# EasyEDA Pro project SprinKlr-8 Rev1.epro, board PCB1
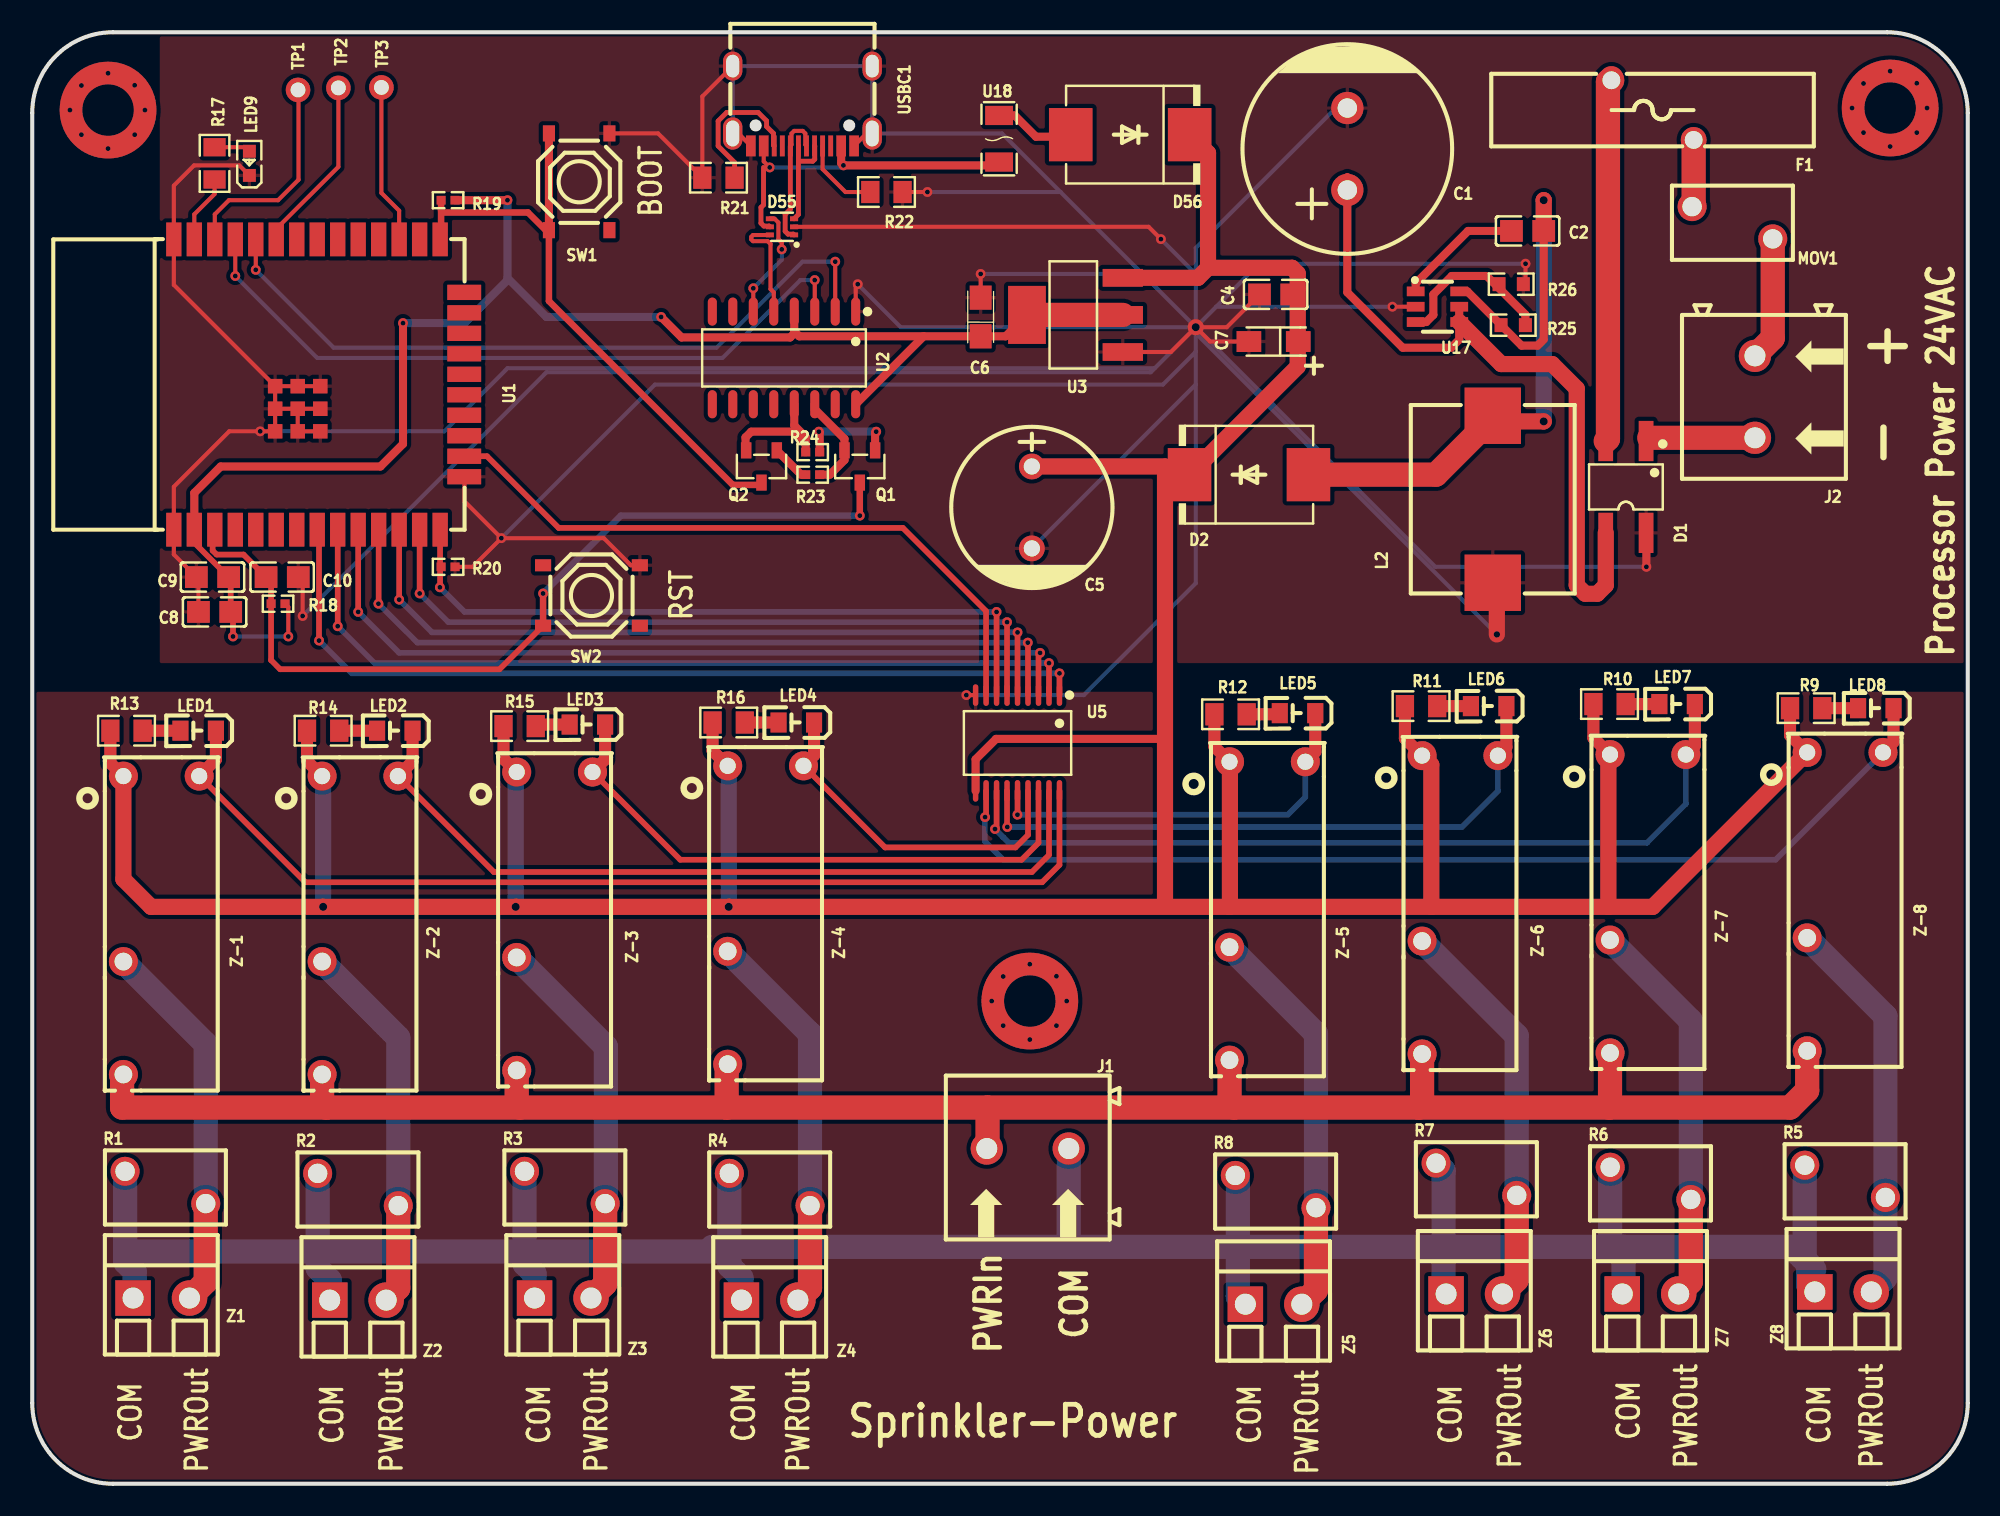
[diagram p1: board, top side]
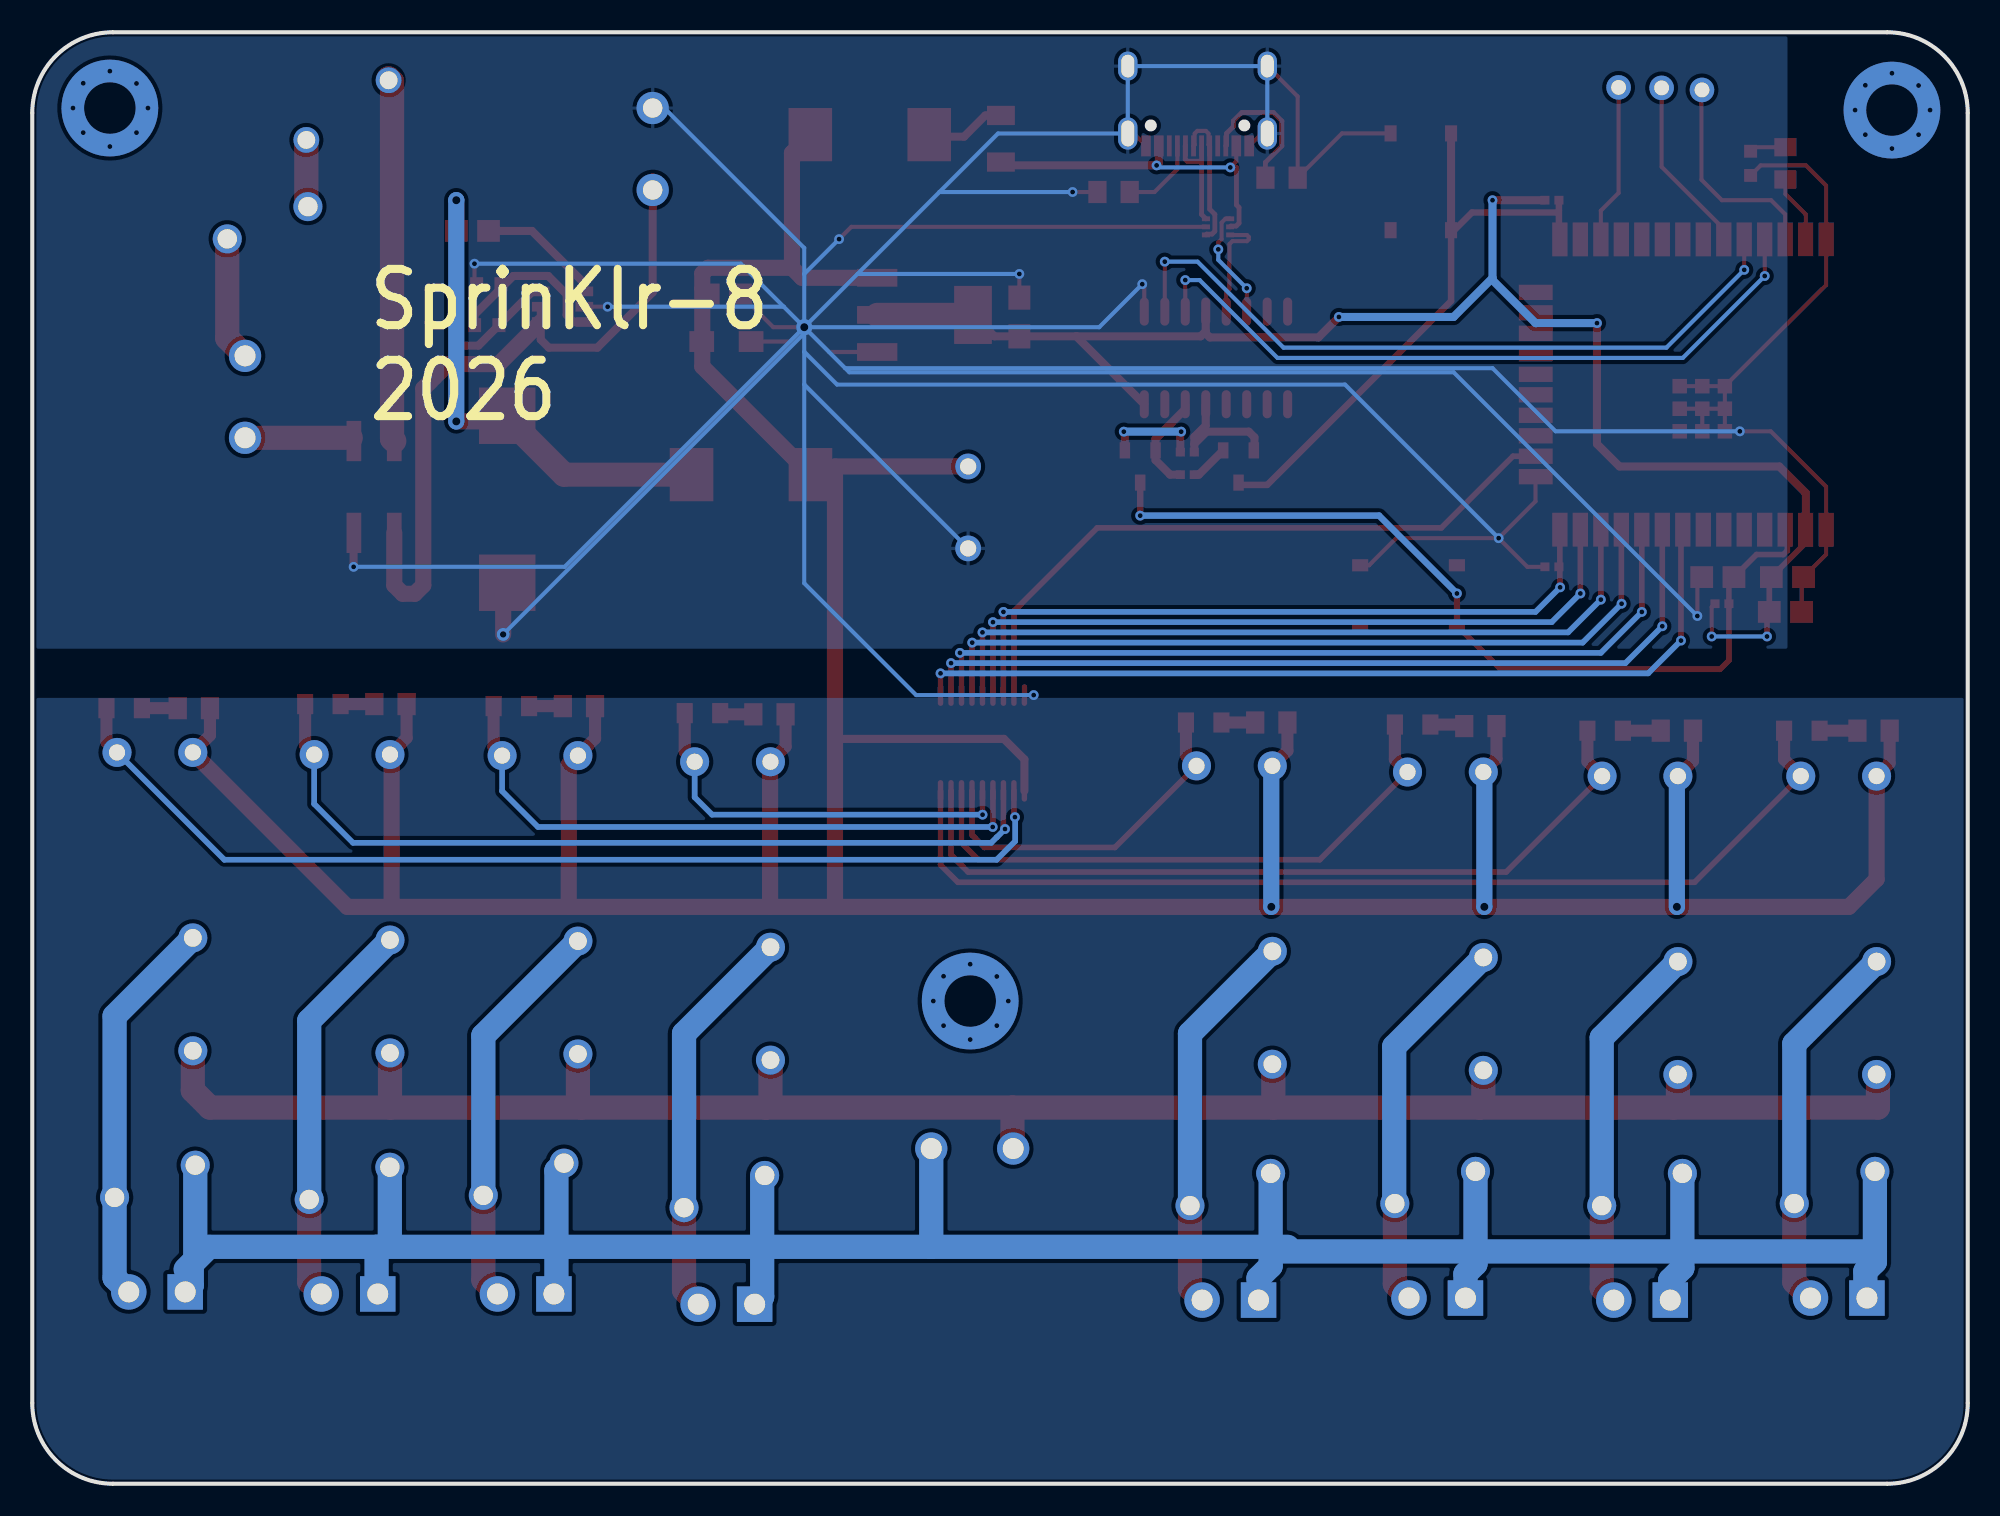
[diagram p2: board, bottom side, seen from below]

Outline 120 x 90 mm; copper layers: Top Layer, Bottom Layer. Coordinates in mm from the lower left corner of the outline.
Outline path: 0,85 0,5 arc(1.46,1.46) 5,0 115,0 arc(118.54,1.46) 120,5 120,85 arc(118.54,88.54) 115,90 5,90 arc(1.46,88.54) 0,85
Stack: Top Layer 0.035mm / Dielectric1 1.51mm FR4 er 4.5 / Bottom Layer 0.035mm

## Design rules (mm)
net $1N11762: DP1
net $1N11753: DP1
spacing copperThickness1oz (default): track to track 0.102, other pairs 0.152 to 0.3
spacing copperThickness2oz: track to track 0.203, other pairs 0.152 to 0.3
spacing Plane_innerPlane: track to track 0.102, other pairs 0.152 to 0.3
spacing Copper_copperRegion: track to track 0.102, other pairs 0.152 to 0.3
track width copperThickness1oz (default): min 0.127, default 0.254, max 2.54
track width copperThickness2oz: min 0.203, default 0.254, max 2.54
differential pair differentialPair (default): width min 0.127, default 0.254, max 2.54; gap min 0.152, default 0.152
differential pair differentialPair1: width min 0.127, default 0.254, max 2.54; gap min 0.152, default 0.152
net GND uses copperRegion_copperThickness1oz
pour e1026 uses Copper_copperRegion, copperRegion_Copper_copperRegion
pour e1129 uses Copper_copperRegion, copperRegion_Copper_copperRegion
pour e1133 uses Copper_copperRegion, copperRegion_Copper_copperRegion
pour e1159 uses Copper_copperRegion, copperRegion_Copper_copperRegion

## Placement (name value [footprint] x y rotation side)
C1  470uF  [CAP-TH_BD13.0-P5.00-D1.2-FD]  81.53 82.76 90 top
C2  100nF  [C0805]  92.71 77.68 180 top
C4  100nF  [C0805]  77.09 73.74 180 top
C5  220uF  [CAP-TH_BD10.0-P5.00-D1.0-FD]  61.98 60.54 270 top
C6  22uF  [CASE-A_3216]  58.8 72.35 90 top
C7  10uF  [CAP-SMD_L3.2-W1.6-RD-C7171]  76.96 70.82 180 top
C8  10uF  [C0805]  11.3 54.06 0 top
C9  100nF  [C0805]  11.18 56.22 0 top
C10  100nF  [C0805]  15.49 56.22 180 top
D1  MB210S  [MBS_L4.7-W4.0-P2.50-LS7.0-BL]  98.81 61.81 180 top
D2  SS35  [SMC_L6.9-W5.9-LS7.9-RD]  75.44 62.57 0 top
D55  USBLC6-2P6  [SOT-666-6_L1.6-W1.2-P0.50-LS1.6-BL]  46.48 77.93 90 top
D56  SS35  [SMC_L6.9-W5.9-LS7.9-RD]  68.07 83.65 180 top
F1  RL250-800  [FUSE-TH_L20.0-W4.5-P5.10-D0.8-S3.70]  100.46 85.17 0 top
J1  WJ500V-5.08-2P  [CONN-TH_2P-P5.00_WJ500V-5.08-2P]  61.72 20.78 180 top
J2  WJ500V-5.08-2P  [CONN-TH_2P-P5.00_WJ500V-5.08-2P]  106.81 67.39 270 top
L2  100uH  [IND-SMD_L11.5-W10.0]  90.55 61.04 270 top
LED1  NCD0805R1  [LED0805-RD]  10.29 46.69 180 top
LED2  NCD0805R1  [LED0805-RD]  22.48 46.69 180 top
LED3  NCD0805R1  [LED0805-RD]  34.42 47.07 180 top
LED4  NCD0805R1  [LED0805-RD]  47.37 47.2 180 top
LED5  NCD0805R1  [LED0805-RD]  78.45 47.78 180 top
LED6  NCD0805R1  [LED0805-RD]  90.3 48.22 180 top
LED7  NCD0805R1  [LED0805-RD]  101.98 48.34 180 top
LED8  NCD0805R1  [LED0805-RD]  114.3 48.09 180 top
LED9  19-217/GHC-YR1S2/3T  [LED0603-RD]  13.46 81.87 90 top
MOV1  250pF@1kHz  [RES-TH_L7.5-W4.6-P5.00-D1.2-S2.00]  105.41 78.19 180 top
NOREF  -  [Pad_e794]  18.98 86.55 0 top
NOREF#2  -  [Pad_e793]  16.48 86.42 0 top
NOREF#3  -  [Pad_e795]  21.65 86.58 0 top
Q1  MMBT3904  [SOT-23-3_L2.9-W1.3-P1.90-LS2.4-BR]  51.31 63.08 90 top
Q2  MMBT3904  [SOT-23-3_L2.9-W1.3-P1.90-LS2.4-BR]  45.21 63.08 90 top
R1  250pF@1kHz  [RES-TH_L7.5-W4.6-P5.00-D1.2-S2.00]  8.25 18.37 0 top
R2  250pF@1kHz  [RES-TH_L7.5-W4.6-P5.00-D1.2-S2.00]  20.19 18.25 0 top
R3  250pF@1kHz  [RES-TH_L7.5-W4.6-P5.00-D1.2-S2.00]  33.02 18.37 0 top
R4  250pF@1kHz  [RES-TH_L7.5-W4.6-P5.00-D1.2-S2.00]  45.72 18.25 0 top
R5  250pF@1kHz  [RES-TH_L7.5-W4.6-P5.00-D1.2-S2.00]  112.4 18.75 0 top
R6  250pF@1kHz  [RES-TH_L7.5-W4.6-P5.00-D1.2-S2.00]  100.33 18.63 0 top
R7  250pF@1kHz  [RES-TH_L7.5-W4.6-P5.00-D1.2-S2.00]  89.53 18.88 0 top
R8  250pF@1kHz  [RES-TH_L7.5-W4.6-P5.00-D1.2-S2.00]  77.09 18.12 0 top
R9  470Ω  [R0805]  109.98 48.09 180 top
R10  470Ω  [R0805]  97.79 48.34 180 top
R11  470Ω  [R0805]  86.11 48.22 180 top
R12  470Ω  [R0805]  74.29 47.71 180 top
R13  470Ω  [R0805]  5.84 46.69 180 top
R14  470Ω  [R0805]  18.03 46.69 180 top
R15  470Ω  [R0805]  30.22 46.98 180 top
R16  470Ω  [R0805]  43.18 47.2 180 top
R17  330Ω  [R0805]  11.3 81.87 270 top
R18  10kΩ  [R0402]  15.24 54.57 180 top
R19  10kΩ  [R0402]  25.78 79.59 0 top
R20  10kΩ  [R0402]  25.78 56.85 180 top
R21  5.1kΩ  [R0805]  42.54 80.98 180 top
R22  5.1kΩ  [R0805]  52.96 80.09 180 top
R23  10kΩ  [R0402]  48.39 62.57 180 top
R24  10kΩ  [R0402]  48.39 63.96 0 top
R25  43kΩ  [R0603]  91.82 71.84 180 top
R26  13kΩ  [R0603]  91.69 74.38 180 top
SW1  TS-1187A-B-A-B  [SW-SMD_4P-L5.1-W5.1-P3.70-LS6.5-TL_H1.5]  33.91 80.73 90 top
SW2  TS-1187A-B-A-B  [SW-SMD_4P-L5.1-W5.1-P3.70-LS6.5-TL_H1.5]  34.67 55.07 180 top
TP1  -  [Test-Point-0.5mm]  16.48 86.42 90 top
TP2  -  [Test-Point-0.5mm]  18.98 86.55 90 top
TP3  -  [Test-Point-0.5mm]  21.65 86.58 90 top
U1  2.4GHz  [WIFI-SMD_ESP32-WROOM-32E]  17.78 68.16 0 top
U2  CH340C  [SOP-16_L10.0-W3.9-P1.27-LS6.0-BL]  46.61 69.81 180 top
U3  AMS1117-3.3  [SOT-223-3_L6.5-W3.4-P2.30-LS7.0-BR]  64.64 72.47 0 top
U5  TBD62083AFNG,EL  [SSOP-18_L6.8-W4.4-P0.65-LS6.4-BL]  61.09 45.93 180 top
U17  LMR16006XDDCR  [SOT-23-6_L2.9-W1.6-P0.95-LS2.8-BR]  87.12 72.98 180 top
U18  1206L050/24NRT  [F1206]  59.94 83.4 270 top
USBC1  TYPE-C-31-M-12  [USB-C_SMD-TYPE-C-31-M-12_1]  47.75 85.43 180 top
Z1  DB125-3.5-2P-GN-S  [CONN-TH_2P-P3.50_L7.4-W7.0]  8 11.51 0 top
Z2  DB125-3.5-2P-GN-S  [CONN-TH_2P-P3.50_L7.4-W7.0]  20.19 11.39 0 top
Z3  DB125-3.5-2P-GN-S  [CONN-TH_2P-P3.50_L7.4-W7.0]  32.89 11.51 0 top
Z4  DB125-3.5-2P-GN-S  [CONN-TH_2P-P3.50_L7.4-W7.0]  45.72 11.39 0 top
Z5  DB125-3.5-2P-GN-S  [CONN-TH_2P-P3.50_L7.4-W7.0]  76.96 11.13 0 top
Z6  DB125-3.5-2P-GN-S  [CONN-TH_2P-P3.50_L7.4-W7.0]  89.41 11.77 0 top
Z7  DB125-3.5-2P-GN-S  [CONN-TH_2P-P3.50_L7.4-W7.0]  100.33 11.77 0 top
Z8  DB125-3.5-2P-GN-S  [CONN-TH_2P-P3.50_L7.4-W7.0]  112.27 11.89 0 top
Z-1  HF46F-G/5-HS1  [RELAYS-TH_HF46F-G-XX-HS1-XXX]  8 34.63 270 top
Z-2  HF46F-G/5-HS1  [RELAYS-TH_HF46F-G-XX-HS1-XXX]  20.32 34.63 270 top
Z-3  HF46F-G/5-HS1  [RELAYS-TH_HF46F-G-XX-HS1-XXX]  32.38 34.88 270 top
Z-4  HF46F-G/5-HS1  [RELAYS-TH_HF46F-G-XX-HS1-XXX]  45.47 35.26 270 top
Z-5  HF46F-G/5-HS1  [RELAYS-TH_HF46F-G-XX-HS1-XXX]  76.58 35.52 270 top
Z-6  HF46F-G/5-HS1  [RELAYS-TH_HF46F-G-XX-HS1-XXX]  88.52 35.9 270 top
Z-7  HF46F-G/5-HS1  [RELAYS-TH_HF46F-G-XX-HS1-XXX]  100.17 35.96 270 top
Z-8  HF46F-G/5-HS1  [RELAYS-TH_HF46F-G-XX-HS1-XXX]  112.4 36.1 270 top

## Footprints (pads in the part's own frame, mm; a bottom-side part is the same pattern mirrored in y, then rotated)
C0805
  rect 1.41x1.35 smd: 1(-1,0) 2(1,0)
CAP-SMD_L3.2-W1.6-RD-C7171
  rect 1.53x1.296 smd: 1(-1.53,0) 2(1.53,0)
CAP-TH_BD10.0-P5.00-D1.0-FD
  round 1.6 hole 1: 1(-2.54,0) 2(2.54,0)
CAP-TH_BD13.0-P5.00-D1.2-FD
  round 2 hole 1.2: 1(-2.54,0) 2(2.54,0)
CASE-A_3216
  rect 1.5x1.359 smd: 1(-1.2,0) 2(1.2,0)
CONN-TH_2P-P3.50_L7.4-W7.0
  rect 2.2x2.2 hole 1.3: 1(-1.75,0)
  round 2.2 hole 1.3: 2(1.75,0)
CONN-TH_2P-P5.00_WJ500V-5.08-2P
  round 2 hole 1.3: 1(-2.54,0) 2(2.54,0)
F1206
  rect 1.19x1.728 smd: 1(-1.445,0) 2(1.445,0)
FUSE-TH_L20.0-W4.5-P5.10-D0.8-S3.70
  round 1.6 hole 1.1: 1(-2.55,1.85) 2(2.55,-1.85)
IND-SMD_L11.5-W10.0
  rect 3.5x3.5 smd: 1(-5.177,0) 2(5.177,0)
LED0603-RD
  rect 0.8x0.8 smd: 1(-0.749,0) 2(0.749,0)
LED0805-RD
  rect 1x1.25 smd: 1(-1.1,0) 2(1.1,0)
MBS_L4.7-W4.0-P2.50-LS7.0-BL
  rect 0.91x2.495 smd: 1(-1.25,-2.848) 2(1.25,-2.848) 3(1.25,2.848) 4(-1.25,2.848)
Pad_e793
  round 1.524 hole 0.914: 1(0,0)
Pad_e794
  round 1.524 hole 0.914: 2(0,0)
Pad_e795
  round 1.524 hole 0.914: 3(0,0)
R0402
  rect 0.566x0.54 smd: 1(-0.433,0) 2(0.433,0)
R0603
  rect 0.806x0.864 smd: 1(-0.753,0) 2(0.753,0)
R0805
  rect 1.133x1.377 smd: 1(-1,0) 2(1,0)
RELAYS-TH_HF46F-G-XX-HS1-XXX
  round 1.8 hole 1: 1(-9.25,-2.35) 6(-9.25,2.35)
  round 1.8 hole 1.1: 2(2.25,-2.35) 3(9.25,-2.35)
RES-TH_L7.5-W4.6-P5.00-D1.2-S2.00
  round 1.8 hole 1.2: 1(-2.5,1) 2(2.5,-1)
SMC_L6.9-W5.9-LS7.9-RD
  rect 2.7x3.3 smd: 1(-3.687,0) 2(3.687,0)
SOP-16_L10.0-W3.9-P1.27-LS6.0-BL
  oval 0.56x1.745 smd: 1(-4.445,-2.873) 2(-3.175,-2.873) 3(-1.905,-2.873) 4(-0.635,-2.873) 5(0.635,-2.873) 6(1.905,-2.873) 7(3.175,-2.873) 8(4.445,-2.873) 9(4.445,2.873) 10(3.175,2.873) 11(1.905,2.873) 12(0.635,2.873) 13(-0.635,2.873) 14(-1.905,2.873) 15(-3.175,2.873) 16(-4.445,2.873)
SOT-23-3_L2.9-W1.3-P1.90-LS2.4-BR
  rect 1x0.65 smd: 1(1,-0.95) 2(1,0.95) 3(-1,0)
SOT-23-6_L2.9-W1.6-P0.95-LS2.8-BR
  rect 1.1x0.6 smd: 1(1.35,-0.95) 2(1.35,0) 3(1.35,0.95) 4(-1.35,0.95) 5(-1.35,0) 6(-1.35,-0.95)
SOT-223-3_L6.5-W3.4-P2.30-LS7.0-BR
  rect 2.5x1.1 smd: 1(2.97,-2.3) 2(2.97,0) 3(2.97,2.3)
  rect 2.34x3.6 smd: 4(-2.97,0)
SOT-666-6_L1.6-W1.2-P0.50-LS1.6-BL
  rect 0.3x0.5 smd: 1(-0.5,-0.75) 2(0,-0.75) 3(0.5,-0.75) 4(0.5,0.75) 5(0,0.75) 6(-0.5,0.75)
SSOP-18_L6.8-W4.4-P0.65-LS6.4-BL
  oval 0.336x1.338 smd: 1(-2.6,-2.969) 2(-1.95,-2.969) 3(-1.3,-2.969) 4(-0.65,-2.969) 5(0,-2.969) 6(0.65,-2.969) 7(1.3,-2.969) 8(1.95,-2.969) 9(2.6,-2.969) 10(2.6,2.969) 11(1.95,2.969) 12(1.3,2.969) 13(0.65,2.969) 14(0,2.969) 15(-0.65,2.969) 16(-1.3,2.969) 17(-1.95,2.969) 18(-2.6,2.969)
SW-SMD_4P-L5.1-W5.1-P3.70-LS6.5-TL_H1.5
  rect 1x0.75 smd: 1(-3,1.875) 2(3,1.875) 3(-3,-1.875) 4(3,-1.875)
Test-Point-0.5mm
  round 0.5 smd: 1(0,0)
USB-C_SMD-TYPE-C-31-M-12_1
  oval 1.2x2 hole 0.8x1.6: 1(4.325,1.706) 4(-4.325,1.706)
  oval 1.2x1.8 hole 0.8x1.4: 2(4.325,-2.474) 3(-4.325,-2.474)
  custom 0.6x1.3 smd: A1B12(-3.2,2.474) A4B9(-2.4,2.474) B1A12(3.2,2.474) B4A9(2.401,2.474)
  rect 0.3x1.3 smd: A5(-1.25,2.474) A6(-0.25,2.474) A7(0.25,2.474) A8(1.25,2.474) B5(1.75,2.474) B6(0.75,2.474) B7(-0.75,2.474) B8(-1.75,2.474)
WIFI-SMD_ESP32-WROOM-32E
  rect 0.95x2.1 smd: 1(-9.002,-9) 2(-7.732,-9) 3(-6.463,-9) 4(-5.192,-9) 5(-3.922,-9) 6(-2.652,-9) 7(-1.383,-9) 8(-0.113,-9) 9(1.157,-9) 10(2.428,-9) 11(3.697,-9) 12(4.968,-9) 13(6.237,-9) 14(7.508,-9) 25(7.508,9) 26(6.237,9) 27(4.968,9) 28(3.697,9) 29(2.428,9) 30(1.157,9) 31(-0.113,9) 32(-1.383,9) 33(-2.652,9) 34(-3.922,9) 35(-5.192,9) 36(-6.463,9) 37(-7.732,9) 38(-9.002,9)
  rect 2.1x0.95 smd: 15(9.002,-5.715) 16(9.002,-4.445) 17(9.002,-3.175) 18(9.002,-1.905) 19(9.002,-0.635) 20(9.002,0.635) 21(9.002,1.905) 22(9.002,3.175) 23(9.002,4.445) 24(9.002,5.715)
  rect 0.9x0.9 smd: 39(-2.721,-0.1) 39(-2.721,-1.5) 39(-2.721,-2.9) 39(-1.321,-0.1) 39(-1.321,-1.5) 39(-1.321,-2.9) 39(0.079,-0.1) 39(0.079,-1.5) 39(0.079,-2.9)

## Nets
As in the schematic, except:
$1N13226: NOREF#2.1 TP1.1 U1.36
$1N13288: NOREF.2 TP2.1 U1.33
$1N13309: NOREF#3.3 TP3.1 U1.27

Pads without a net: SW1 3; SW2 1 4; U1 4 5 6 7 17 18 19 20 21 22 23 24 26 28 29 30 31 32; U2 7 8 9 10 11 12 15; USBC1 A8 B8

## Via types
v1: diameter 0.61, hole 0.305, Top Layer to Bottom Layer, 70 vias
v2: diameter 6, hole 3.2, Top Layer to Bottom Layer, 3 vias
v3: diameter 0.8, hole 0.4, Top Layer to Bottom Layer, 1 via
v4: diameter 1, hole 0.5, Top Layer to Bottom Layer, 6 vias

## Routing (per net, layer and track width the routed paths; a pad name or vN(x,y) marks a point on that pad's centre or on a via; arc(x,y) is an arc through that point)
3V3: length 100.7
  Top Layer w0.254: R18.1 15.88,54.36 v1(15.88,52.53)
  Top Layer w0.35: v1(12.45,52.53) 12.45,53.92 C8.2 12.3,56.09 C9.2 10.05,58.35 U1.2
  Top Layer w0.5: v1(38.99,72.35) 40.26,71.08 46.99,71.08 47.24,71.33 47.24,71.46 ; 47.24,71.46 47.56,71.15 55.27,71.15 ; 47.24,71.46 U2.4 ; v1(29.46,79.59) R19.2 ; v1(22.99,71.97) 22.99,64.47 21.59,63.08 11.68,63.08 10.05,61.44 U1.2 ; U2.16 55.27,71.15 ; 55.27,71.15 C6.1 60.35,71.15 U3.4
  Top Layer w1.5: U3.4 U3.2
  Bottom Layer w0.254: v1(12.45,52.53) v1(15.88,52.53)
  Bottom Layer w0.5: 29.46,74.76 31.88,72.35 v1(38.99,72.35) ; 29.46,74.76 v1(29.46,79.59) ; 29.46,74.76 29.46,74.63 26.8,71.97 v1(22.99,71.97)
5V: length 280
  Top Layer w0.5: 78.46,74.11 C4.1 ; U5.10 58.49,44.91 59.76,46.18 69.98,46.18 ; 78.46,70.86 C7.1
  Top Layer w0.75: Z-2.1 17.03,44.81 R14.2 ; Z-3.1 29.22,44.95 R15.2 ; R12.2 73.29,45.7 Z-5.1 ; Z-4.1 42.18,45.45 R16.2 ; R10.2 96.79,46.25 97.82,45.21 ; R13.2 4.84,44.69 Z-1.1 ; R11.2 85.11,46.21 Z-6.1 ; Z-8.1 108.98,46.41 R9.2
  Top Layer w1: 97.72,35.77 97.72,45.11 97.82,45.21 ; 97.72,35.77 86.74,35.77 ; 97.72,35.77 100.47,35.77 Z-8.1 ; C5.1 70.23,63.08 70.23,36.15 ; 72.9,75.39 72.9,82.51 D56.1 ; 72.9,75.39 72.28,74.77 U3.3 ; 72.9,75.39 78.1,75.39 78.46,75.04 78.46,69.27 D2.1 ; Z-6.1 86.74,44.58 86.74,35.77 ; 86.74,35.77 74.26,35.77 ; 74.26,35.77 v4(43.18,35.77) v4(29.97,35.77) v4(18.03,35.77) 7.37,35.77 5.65,37.49 Z-1.1 ; 74.26,35.77 74.26,44.74 Z-5.1
  Bottom Layer w1: v4(18.03,35.77) 18.03,43.81 Z-2.1 ; v4(43.18,35.77) 43.18,44.45 Z-4.1 ; v4(29.97,35.77) 29.97,44.07 Z-3.1
24VAC: length 129.2
  Top Layer w1.5: 43.05,23.32 43.05,25.95 Z-4.3 ; 43.05,23.32 59.23,23.32 ; 43.05,23.32 30.24,23.32 ; Z-7.3 97.82,23.36 97.78,23.32 ; Z-5.3 74.23,23.61 74.51,23.32 ; 85.96,23.32 97.78,23.32 ; 85.96,23.32 86.17,23.53 Z-6.3 ; 85.96,23.32 74.51,23.32 ; 97.78,23.32 108.98,23.32 110.04,24.39 Z-8.3 ; 74.51,23.32 59.23,23.32 ; 18.24,23.32 17.97,23.59 Z-2.3 ; 18.24,23.32 5.57,23.32 5.57,25.3 Z-1.3 ; 18.24,23.32 30.24,23.32 ; 59.23,23.32 59.23,20.83 59.18,20.78 ; 30.24,23.32 30.03,23.53 Z-3.3
24VAC_R: length 177.1
  Bottom Layer w1.5: 87.5,14.69 87.5,19.41 R7.1 ; 87.5,14.69 87.5,11.92 Z6.1 ; 87.5,14.69 74.75,14.69 ; 87.5,14.69 98.65,14.69 ; 97.79,14.94 97.83,14.98 R6.1 ; 17.69,14.41 17.69,13.38 18.44,12.63 Z2.1 ; 17.69,14.41 R2.1 ; 17.69,14.41 5.75,14.41 ; 17.69,14.41 30.52,14.41 ; 30.52,14.41 43.22,14.41 43.22,13.51 43.97,12.76 Z4.1 ; 30.52,14.41 30.52,13.63 31.14,13.01 Z3.1 ; 30.52,14.41 R3.1 ; 98.65,14.69 109.05,14.69 110.11,13.63 110.11,12.3 Z8.1 ; 98.65,14.69 98.65,11.84 Z7.1 ; 74.75,14.69 74.75,11.6 Z5.1 ; 74.75,14.69 74.75,18.96 R8.1 ; 74.75,14.69 64.26,14.69 ; 110.49,13.29 109.9,13.89 R5.1 ; 5.75,14.41 5.75,13.76 6.35,13.16 6.35,11.61 Z1.1 ; 5.75,14.41 R1.1 ; 64.26,14.69 J1.1 ; 64.26,14.69 43.22,14.69 ; R4.1 43.22,14.69 ; 43.22,14.69 42.16,14.69
GND: length 546.8
  Top Layer w0.254: C7.2 73.03,70.82 v4(72.14,71.71) ; SW1.4 38.8,83.73 R21.2 41.54,86.02 43.43,87.9 ; U1.39 U1.39 U1.39 ; U1.39 U1.39 ; U1.39 U1.39 ; v1(16.76,53.8) 16.76,55.95 C10.1 ; USBC1.A1B12 51.72,83.72 USBC1.4 ; R22.1 v1(55.5,80.09) ; v1(69.98,77.17) 69.22,77.93 D55.2 ; USBC1.B1A12 43.78,83.72 USBC1.1 ; v1(92.58,75.65) 92.58,74.51 R26.1 ; U1.39 U1.39 v1(14.13,65.26) 12.21,65.26 8.78,61.82 U1.1 8.78,57.62 C9.1 10.3,56.09 C8.1 ; U1.39 U1.39 ; v1(29.08,58.63) 26.8,60.92 26.8,62.43 U1.15 ; v1(29.08,58.63) 35.43,58.63 37.11,56.95 SW2.3 ; v1(29.08,58.63) 27.3,56.85 R20.1 ; U1.39 U1.39 U1.39 ; U1.39 8.78,74.34 U1.38 8.78,80.49 10.03,81.74 12.84,81.74 LED9.1 ; v4(72.14,71.71) 74.06,71.71 C4.2 ; v4(72.14,71.71) 70.6,70.17 U3.1 ; U17.2 v1(84.33,72.98) ; U2.1 51.05,74.25 v1(51.18,74.38) ; C6.2 v1(58.8,75.01) ; U5.9 v1(57.91,48.9)
  Top Layer w0.5: 100.08,58.25 v1(100.08,56.85)
  Top Layer w1: v3(90.81,52.66) 90.81,55.61 L2.2
  Bottom Layer w0.254: v1(100.08,56.85) 87,56.85 v4(72.14,71.71) ; v1(58.8,75.01) 68.83,75.01 ; 68.83,75.01 v4(72.14,71.71) ; 68.83,75.01 63.75,80.09 ; 72.14,75.01 v4(72.14,71.71) ; 72.14,75.01 72.14,76.62 81.53,86.02 ; 72.14,75.01 v1(69.98,77.17) ; v4(72.14,71.71) 73.41,72.98 ; v4(72.14,71.71) 53.85,71.71 v1(51.18,74.38) ; v4(72.14,71.71) 69.6,69.17 ; 63.75,80.09 60.13,83.72 USBC1.4 52.08,87.9 43.43,87.9 USBC1.1 ; 63.75,80.09 v1(55.5,80.09) ; 72.14,68.16 72.14,55.84 65.2,48.9 v1(57.91,48.9) ; 72.14,68.16 72.14,70.19 ; 72.14,68.16 C5.2 ; v1(29.08,58.63) 38.61,68.16 70.1,68.16 72.14,70.19 ; v1(84.33,72.98) 73.41,72.98 ; 73.41,72.98 76.07,75.65 v1(92.58,75.65) ; 72.14,70.19 72.14,71.33 v3(90.81,52.66) ; v1(14.13,65.26) 25.55,65.26 29.46,69.17 69.6,69.17 ; v1(16.76,53.8) 31.88,68.92 69.34,68.92 69.6,69.17
(no net):
  vias: v1(2.34,85.17) v1(3.05,86.7) v1(3.05,83.65) v1(4.7,87.46) v1(4.7,82.79) v1(6.35,86.71) v1(6.35,83.65) v1(6.98,85.17) v1(59.49,29.93) v1(60.2,31.45) v1(60.2,28.4) v1(61.85,32.21) v1(61.85,27.54) v1(63.5,31.47) v1(63.5,28.4) v1(64.13,29.93) v1(112.83,85.3) v1(113.54,86.82) v1(113.54,83.78) v1(115.19,87.59) v1(115.19,82.91) v1(116.84,86.84) v1(116.84,83.78) v1(117.47,85.3) v2(4.7,85.17) v2(61.85,29.93) v2(115.19,85.3)
1C: length 64.3
  Top Layer w0.35: Z-1.6 16.93,37.29 62.61,37.29 63.69,38.37 U5.18
  Top Layer w0.75: Z-1.6 11.39,44.91 LED1.1
2C: length 50.4
  Top Layer w0.35: Z-2.6 28.62,37.93 61.98,37.93 63.04,38.99 U5.17
  Top Layer w0.75: Z-2.6 23.58,44.79 LED2.1
3C: length 36.8
  Top Layer w0.35: U5.16 62.39,39.74 61.34,38.69 40.18,38.69 Z-3.6
  Top Layer w0.75: Z-3.6 35.52,44.91 LED3.1
4C: length 22
  Top Layer w0.35: U5.15 61.74,40.23 60.96,39.45 52.88,39.45 Z-4.6
  Top Layer w0.75: Z-4.6 48.47,45.17 LED4.1
5C: length 25.2
  Top Layer w0.35: v1(61.08,41.49) 61.09,41.49 U5.14
  Top Layer w0.75: LED5.1 79.55,45.38 Z-5.6
  Bottom Layer w0.35: v1(61.08,41.49) 77.85,41.49 78.93,42.57 Z-5.6
6C: length 39.1
  Top Layer w0.35: U5.13 60.44,40.74 v1(60.45,40.72)
  Top Layer w0.75: Z-6.6 91.4,45.68 LED6.1
  Bottom Layer w0.35: v1(60.45,40.72) 88.65,40.72 90.87,42.95 Z-6.6
7C: length 53
  Top Layer w0.35: v1(59.69,40.6) 59.79,40.69 U5.12
  Top Layer w0.75: 102.52,45.21 103.08,45.77 LED7.1
  Bottom Layer w0.35: 102.52,45.21 102.52,42.15 100.11,39.74 60.54,39.74 60.19,40.09 60.19,40.09 59.82,40.46 59.82,40.47 v1(59.69,40.6)
8C: length 65.1
  Top Layer w0.35: v1(59.07,41.33) 59.14,41.4 U5.11
  Top Layer w0.75: LED8.1 115.4,46 Z-8.6
  Bottom Layer w0.35: Z-8.6 108.09,38.69 60.21,38.69 59.06,39.84 59.06,41.32 v1(59.07,41.33)
EN: length 54.5
  Top Layer w0.35: SW2.2 28.97,50.5 15.37,50.5 14.81,51.06 R18.2 14.81,55.9 C10.2 13.1,57.61 11.43,57.61 11.18,57.86 11.18,59.02 U1.3
  Top Layer w0.4: SW2.2 v1(31.67,55.2) ; v1(51.31,60.03) Q1.3
  Bottom Layer w0.4: v1(31.67,55.2) 36.5,60.03 v1(51.31,60.03)
IO0: length 37.9
  Top Layer w0.4: U1.25 25.35,77.22 25.35,78.93 ; 25.35,78.93 25.45,78.82 30.73,78.82 32.03,77.52 32.03,73.33 43.43,61.93 45.07,61.93 Q2.3 ; 25.35,78.93 25.35,79.59
  Top Layer w0.5: SW1.1 SW1.2
IO12: length 43.9
  Top Layer w0.35: v1(25.27,55.58) 25.29,55.6 U1.14 ; U5.7 v1(59.79,54.06)
  Bottom Layer w0.35: v1(59.79,54.06) 26.8,54.06 v1(25.27,55.58)
IO13: length 41.5
  Top Layer w0.35: U5.8 59.14,54.1 53.97,59.27 32.64,59.27 28.19,63.71 U1.16
IO14: length 45.6
  Top Layer w0.35: U5.6 v1(60.44,53.42) ; U1.13 v1(24.02,55.2)
  Bottom Layer w0.35: v1(24.02,55.2) 25.8,53.42 v1(60.44,53.42)
IO25: length 51.1
  Top Layer w0.35: U5.3 62.39,51.42 v1(62.48,51.52) ; U1.10 v1(20.21,54.06)
  Bottom Layer w0.35: v1(20.21,54.06) 22.75,51.52 v1(62.48,51.52)
IO26: length 49.1
  Top Layer w0.35: v1(61.72,52.15) 61.74,52.14 U5.4 ; v1(21.46,54.57) 21.48,54.58 U1.11
  Bottom Layer w0.35: v1(61.72,52.15) 23.88,52.15 v1(21.46,54.57)
IO27: length 47.4
  Top Layer w0.35: U1.12 v1(22.75,54.82) ; U5.5 v1(61.09,52.79)
  Bottom Layer w0.35: v1(61.09,52.79) 24.78,52.79 v1(22.75,54.82)
IO32: length 55
  Top Layer w0.35: U1.8 17.78,59.04 v1(17.78,52.28) ; U5.1 v1(63.69,50.25)
  Bottom Layer w0.35: v1(17.78,52.28) 19.81,50.25 v1(63.69,50.25)
IO33: length 53
  Top Layer w0.35: U1.9 v1(18.94,53.17) ; U5.2 v1(63.04,50.88)
  Bottom Layer w0.35: v1(18.94,53.17) 21.22,50.88 v1(63.04,50.88)
RX: length 44.3
  Top Layer w0.254: U1.35 v1(12.59,74.89) ; U2.3 v1(48.51,74.63)
  Bottom Layer w0.254: v1(48.51,74.63) 47.62,74.63 42.79,69.81 17.67,69.81 v1(12.59,74.89)
TX: length 45.1
  Top Layer w0.254: U1.34 v1(13.86,75.27) ; v1(49.78,75.78) U2.2
  Bottom Layer w0.254: v1(49.78,75.78) 47.75,75.78 42.42,70.44 18.68,70.44 v1(13.86,75.27)
USB_5V: length 21.3
  Top Layer w0.254: USBC1.B4A9 45.35,81.99 v1(45.72,81.62)
  Top Layer w0.3: 45.34,81.62 45.34,79.3 45.18,79.14 45.18,78.16 45.36,77.98 45.68,77.98 D55.5
  Top Layer w0.5: U18.2 59.74,81.74 v1(50.29,81.74) 50.15,81.88 USBC1.A4B9
  Bottom Layer w0.254: v1(50.29,81.74) 50.16,81.62 v1(45.72,81.62)
$1N3315: length 2.2
  Top Layer w0.75: R9.1 LED8.2
$1N3354: length 2.1
  Top Layer w0.75: R10.1 LED7.2
$1N3393: length 2.1
  Top Layer w0.75: R11.1 LED6.2
$1N3432: length 2.1
  Top Layer w0.75: LED5.2 77.28,47.71 R12.1
$1N3508: length 2.3
  Top Layer w0.75: R14.1 LED2.2
$1N3547: length 2.1
  Top Layer w0.75: LED3.2 31.31,47.07 R15.1
$1N3586: length 2.1
  Top Layer w0.75: LED4.2 R16.1
$1N3625: length 2.3
  Top Layer w0.75: R13.1 LED1.2
$1N6681: length 6.6
  Top Layer w1.5: J2.2 100.26,64.85
$1N6717: length 7.7
  Top Layer w1.5: MOV1.1 107.91,71.04 J2.1
$1N6731: length 22.6
  Top Layer w1.5: 97.91,87.15 97.69,86.94 97.69,64.79 D1.2
$1N6785: length 44.4
  Top Layer w0.254: 88.47,72.03 88.47,71.61
  Top Layer w0.5: 81.53,81.02 81.53,73.87 84.96,70.44 87.97,70.44 88.47,70.94 88.47,71.61 ; 88.47,72.98 88.47,72.03
  Top Layer w1: D1.3 97.56,55.71 97.03,55.18 96.28,55.18 95.76,55.71 95.76,67.9 94.23,69.43 91.08,69.43 88.47,72.03
$1N7201: length 45.4
  Top Layer w0.5: 88.47,73.93 88.97,73.93 R25.2 92.34,70.57 93.33,70.57 93.71,70.95 C2.1
  Top Layer w1: 90.68,66.22 91.03,65.87 v4(93.71,65.87) ; C2.1 v4(93.71,79.59)
  Top Layer w1.5: 90.68,66.22 87.03,62.57 D2.2
  Bottom Layer w1: v4(93.71,79.59) v4(93.71,65.87)
$1N8527: length 4.2
  Top Layer w0.254: R17.2 11.3,79.97 10.05,78.71 U1.37
$1N9069: length 9.1
  Top Layer w0.3: USBC1.B5 45.95,83 45.95,83.73 45.53,84.15 45.53,84.5 45.01,85.02 43.05,85.02 42.53,84.5 42.53,82.95 43.54,81.93 R21.1
$1N9075: length 5
  Top Layer w0.254: USBC1.A5 49,81.51 50.42,80.09 R22.2
$1N11753: length 6.9
  Top Layer w0.254: 45.97,72.68 45.97,73.87 45.77,74.07 45.77,76.87 45.59,77.05 44.69,77.05 44.58,77.16 44.58,77.32 44.69,77.43 45.72,77.43 D55.6
$1N11759: length 8.7
  Top Layer w0.254: USBC1.B6 47.07,83.02 47.07,83.72 47.24,83.88 47.77,83.88 47.93,83.72 47.93,83.02 USBC1.A6
  Top Layer w0.3: D55.1 47.18,77.48 46.86,77.48 46.68,77.66 46.68,78.71 47,79.03 USBC1.B6
$1N11762: length 7
  Top Layer w0.254: v1(46.47,76.54) 46.47,76.96 46.26,77.17 46.26,78.2 46.02,78.44 45.74,78.44 D55.4 ; U2.6 v1(44.7,74.12)
  Bottom Layer w0.254: v1(46.47,76.54) 46.47,75.89 v1(44.7,74.12)
$1N11768: length 6.5
  Top Layer w0.3: 47.5,82 USBC1.A7 ; 47.5,82 47.5,78.7 D55.3 ; 47.5,82 48.39,82 48.51,82.13 48.51,82.94 USBC1.B7
$1N11893: length 6.1
  Top Layer w0.5: U2.14 48.51,66.63 50.36,64.79 Q1.2 50.36,63.47 49.45,62.57 R23.1
$1N11932: length 8.3
  Top Layer w0.5: 47.95,64.47 47.19,65.23 44.58,65.23 44.22,64.88 44.22,64.11 Q2.2 ; 47.95,64.47 R24.1 ; 47.95,64.47 47.95,64.91 47.24,65.62 U2.13
$1N12077: length 2.4
  Top Layer w0.5: R23.2 47.67,62.57 Q2.1
$1N12134: length 6
  Top Layer w0.5: Q1.1 52.26,65.17 v1(52.32,65.23) ; v1(48.77,65.23) 48.82,65.18 R24.2
  Bottom Layer w0.5: v1(48.77,65.23) v1(52.32,65.23)
$1N12369: length 5
  Top Layer w0.5: D56.2 64.26,83.52 62.23,83.52 60.91,84.84 U18.1
$1N12551: length 23.4
  Top Layer w1.5: R1.2 10.75,12.52 Z1.2
  Bottom Layer w1.5: R1.2 10.75,27.27 Z-1.2
$1N12643: length 23.3
  Top Layer w1.5: R2.2 22.69,12.14 Z2.2
  Bottom Layer w1.5: Z-2.2 22.69,27.65 R2.2
$1N13021: length 24.3
  Bottom Layer w1.5: Z8.2 114.9,12.77 R5.2 114.9,29 Z-8.2
$1N13219: length 2.3
  Top Layer w0.254: R17.1 13.21,82.87 LED9.2
$1N13226: length 13.2
  Top Layer w0.254: U1.36 11.32,78.71 12.19,79.59 15.24,79.59 16.51,80.86 16.51,86.42 TP1.1
$1N13288: length 11
  Top Layer w0.254: NOREF.2 18.98,81.66 15.13,77.81 U1.33
$1N13309: length 9.9
  Top Layer w0.254: U1.27 22.75,78.94 21.65,80.04 TP3.1
$1N13317: length 7.8
  Top Layer w0.5: U17.1 85.77,74.43 89.02,77.68 C2.2
$1N13320: length 10.4
  Top Layer w0.5: R25.1 92.57,72.49 90.18,74.89 88.01,74.89 86.87,73.75 86.87,72.47 86.43,72.03 U17.3
$1N13341: length 24.1
  Top Layer w1.5: R4.2 48.22,12.14 Z4.2
  Bottom Layer w1.5: Z-4.2 48.22,27.91 R4.2
$1N13344: length 23.8
  Top Layer w1.5: Z3.2 35.52,12.39 R3.2
  Bottom Layer w1.5: R3.2 35.56,17.41 35.56,27.11 Z-3.2
$1N13347: length 24.7
  Top Layer w1.5: R8.2 79.59,12.01 Z5.2
  Bottom Layer w1.5: R8.2 79.59,27.91 Z-5.2
$1N13350: length 24.7
  Top Layer w1.5: Z6.2 92.03,12.64 R7.2
  Bottom Layer w1.5: R7.2 92.03,27.78 Z-6.2
$1N13353: length 24.3
  Top Layer w1.5: R6.2 102.83,12.52 Z7.2
  Bottom Layer w1.5: R6.2 102.83,28.71 Z-7.2
$1N13379: length 4.2
  Top Layer w1.5: F1.2 103.01,79.29 MOV1.2

## Copper pours and planes (outline as drawn; the poured copper is in the pictures)
GND on Top Layer: -0.51,49.11 119.89,49.11 119.89,-2.2 -0.51,-2.2
GND on Top Layer: 7.9,90 121.28,90 121.28,50.88 7.9,50.88
GND on Bottom Layer: -0.51,48.72 120.52,48.72 120.52,-0.81 -0.51,-0.81
GND on Bottom Layer: 11.18,92.54 121.67,92.54 121.67,51.77 11.18,51.77

## Text on the board
Bottom Silkscreen Layer: SprinKlr-8 / 2026
Top Silkscreen Layer: COM | PWROut | BOOT | RST | PWRIn | Processor Power 24VAC | Sprinkler-Power | - | +
